# Altium schematic sheet Kivipallur_joonis3.SchDoc
size A4; SheetNumber: 4; SheetTotal: 4
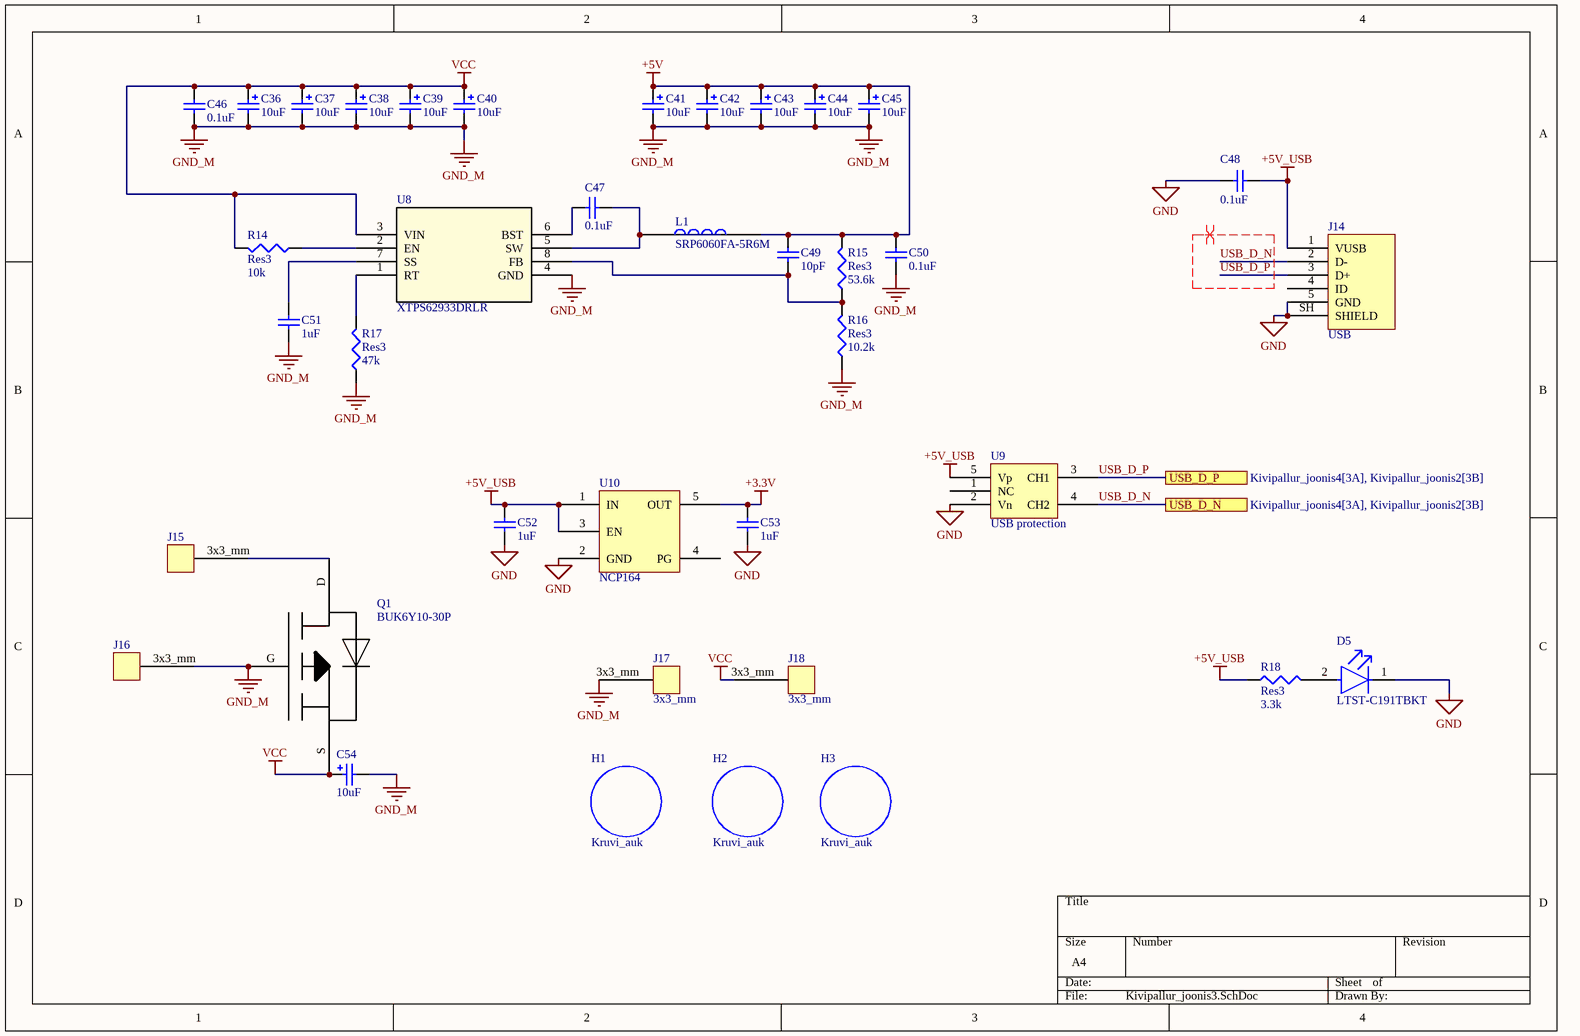
[diagram p0: Kivipallur_joonis3.SchDoc]

## Parts
C36  value 10uF  [C0805]  (hidden comment: Cap Pol3)
C37  value 10uF  [C0805]  (hidden comment: Cap Pol3)
C38  value 10uF  [C0805]  (hidden comment: Cap Pol3)
C39  value 10uF  [C0805]  (hidden comment: Cap Pol3)
C40  value 10uF  [C0805]  (hidden comment: Cap Pol3)
C41  value 10uF  [C0805]  (hidden comment: Cap Pol3)
C42  value 10uF  [C0805]  (hidden comment: Cap Pol3)
C43  value 10uF  [C0805]  (hidden comment: Cap Pol3)
C44  value 10uF  [C0805]  (hidden comment: Cap Pol3)
C45  value 10uF  [C0805]  (hidden comment: Cap Pol3)
C46  value 0.1uF  [1608[0603]]  (hidden comment: Cap Semi)
C47  value 0.1uF  [1608[0603]]  (hidden comment: Cap Semi)
C48  value 0.1uF  [1608[0603]]  (hidden comment: Cap Semi)
C49  value 10pF  [1608[0603]]  (hidden comment: Cap Semi)
C50  value 0.1uF  [1608[0603]]  (hidden comment: Cap Semi)
C51  value 1uF  [1608[0603]]  (hidden comment: Cap Semi)
C52  value 1uF  [1608[0603]]  (hidden comment: Cap Semi)
C53  value 1uF  [1608[0603]]  (hidden comment: Cap Semi)
C54  value 10uF  [C0805]  (hidden comment: Cap Pol3)
D5  LTST-C191TBKT  [FP-LTST-C191TBKT-MFG]
H1  Kruvi_auk  [kruvi_auk]
H2  Kruvi_auk  [kruvi_auk]
H3  Kruvi_auk  [kruvi_auk]
J14  USB  [USB]
J15  3x3_mm  [3x3_mm]  (value not drawn)
J16  3x3_mm  [3x3_mm]  (value not drawn)
J17  3x3_mm  [3x3_mm]
J18  3x3_mm  [3x3_mm]
L1  SRP6060FA-5R6M  [SRP6060FA-5R6M]
Q1  BUK6Y10-30P  [BUK6Y10-30P]
R14  Res3  value 10k  [J1-0603]
R15  Res3  value 53.6k  [J1-0603]
R16  Res3  value 10.2k  [J1-0603]
R17  Res3  value 47k  [J1-0603]
R18  Res3  value 3.3k  [J1-0603]
U8  XTPS62933DRLR  [SOT_33DRLR_TEX]
U9  USB protection  [USB protection]
U10  NCP164  [NCP164]

## Ports
USB_D_N (see Kivipallur_joonis4[3A], Kivipallur_joonis2[3B]), USB_D_P (see Kivipallur_joonis4[3A], Kivipallur_joonis2[3B])

## Nets
+3.3V: C53.1 U10.5(OUT)
+5V: C41.1 C42.1 C43.1 C44.1 C45.1 C49.1 C50.1 L1.2 R15.2
+5V_USB: C48.1 C52.1 J14.1(VUSB) R18.1 U9.5(Vp) U10.1(IN) U10.3(EN)
GND: C48.2 C52.2 C53.2 D5.1(C) J14.5(GND) J14.SH(SHIELD) U9.2(Vn) U10.2(GND)
GND_M: C36.2 C37.2 C38.2 C39.2 C40.2 C41.2 C42.2 C43.2 C44.2 C45.2 C46.2 C50.2 C51.2 C54.2 J16.3x3_mm J17.3x3_mm Q1.G R16.1 R17.1 U8.4(GND)
VCC: C36.1 C37.1 C38.1 C39.1 C40.1 C46.1 C54.1 J18.3x3_mm Q1.S R14.2 U8.3(VIN)
USB_D_N: J14.2(D-) U9.4(CH2) ; port USB_D_N
USB_D_P: J14.3(D+) U9.3(CH1) ; port USB_D_P
NetC47_1: C47.1 U8.6(BST)
NetC47_2: C47.2 L1.1 U8.5(SW)
NetC49_2: C49.2 R15.1 R16.2 U8.8(FB)
NetC51_1: C51.1 U8.7(SS)
NetD5_2: D5.2(A) R18.2
NetJ15_3x3_mm: J15.3x3_mm Q1.D
NetR14_1: R14.1 U8.2(EN)
NetR17_2: R17.2 U8.1(RT)

Not connected (* = marked no-connect by the designer): J14 4(ID); U9 1(NC); U10 4(PG)

## Layout directives
differential pair; differential pair class USB: USB_D_N, USB_D_P

## Library data of the parts
C36-C45 C54 = Cap Pol3: Polarized Capacitor (Surface Mount); Published: 8-Jun-2000; PackageReference: C0805; Publisher: Altium Limited; PackageDescription: Chip Capacitor; LatestRevisionDate: 29-May-2009; LatestRevisionNote: IPC-7351 Footprint Added.
C46-C53 = Cap Semi: Capacitor (Semiconductor SIM Model); Published: 8-Jun-2000; PackageReference: C1206; Publisher: Altium Limited; PackageDescription: Chip Capacitor; LatestRevisionDate: 29-May-2009; LatestRevisionNote: IPC-7351 Footprint Added.
D5 = CMP-22017-000008-1: LED BLUE CLEAR CHIP SMD; Lens Color: Colorless; Dominant Wavelength: 475nm; Forward Current: 20mA; Wavelength: 468nm; Viewing Angle: 130°; Power Dissipation: 76mW; Luminous Intensity: 180mcd; Reverse Voltage: 5V; Number of Elements: 1; Lens Style: Diffused; Forward Voltage: 3.8V; Max Power Dissipation: 75mW; Case Code (Metric): 1608; Packaging: Tape and Reel; Case/Package: 0603; Depth: 1.6mm; Mount: Surface Mount; Lead Free: Lead Free; Min Operating Temperature: -20°C; Lens Transparency: Clear; Illumination Color: Blue; Height: 0.55mm; Test Current: 20mA; Case Code (Imperial): 0603; Max Operating Temperature: 80°C; Number of Pins: 2; Length: 0.8mm; Radiation Hardening: No; Package Quantity: 1; Number of LEDs: 1; Width: 0.8mm; Color: Blue
R14-R18 = Res3: Resistor; Published: 8-Jun-2000; LatestRevisionDate: 29-May-2009; LatestRevisionNote: IPC-7351 Footprint Added.; PackageReference: J1-0603; Publisher: Altium Limited; PackageDescription: Chip Resistor
U8 = XTPS62933DRLR: No Description Available; Mfr_Name: Texas Instruments; Copyright: Copyright (C) 2022 Ultra Librarian. All rights reserved.; Manufacturer_Part_Number: XTPS62933DRLR; RefDes: RefDes; Type: DEV